# Altium project fast-open-switch r1.0.PrjPcb (part 7 of 8)

## Sheet Spare Pins.SchDoc
size A3; SheetNumber: 20; SheetTotal: 22
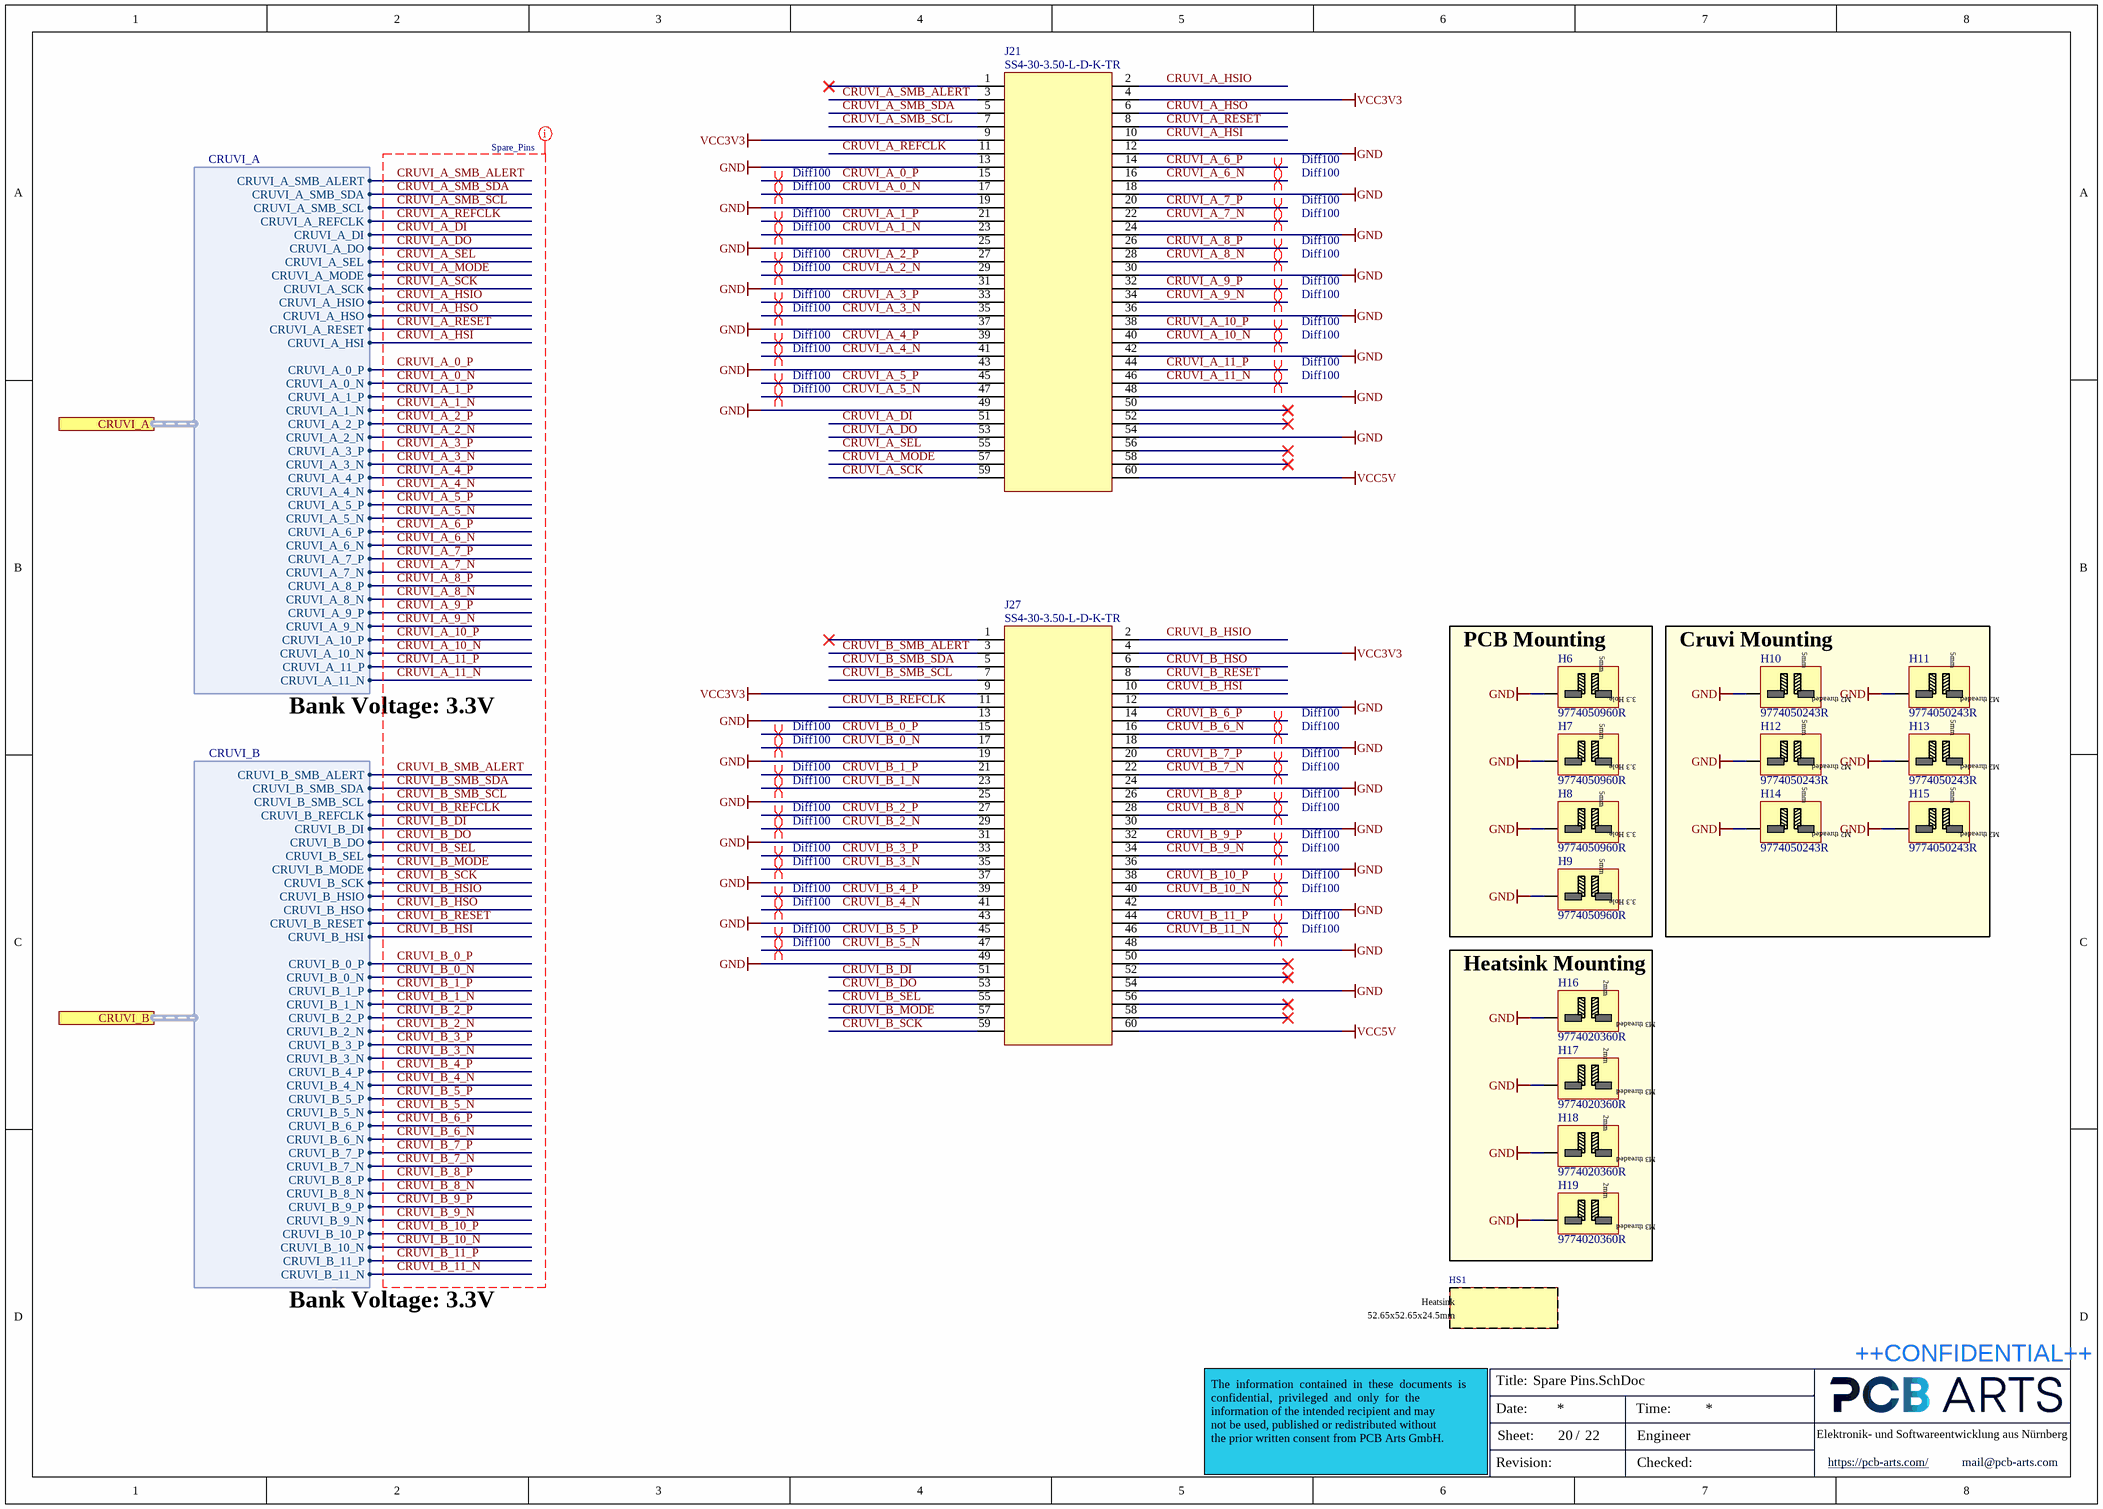
[diagram p21: Spare Pins.SchDoc]

### Parts
H6  9774050960R  [9774050960R]
H7  9774050960R  [9774050960R]
H8  9774050960R  [9774050960R]
H9  9774050960R  [9774050960R]
H10  9774050243R  [9774050243R]
H11  9774050243R  [9774050243R]
H12  9774050243R  [9774050243R]
H13  9774050243R  [9774050243R]
H14  9774050243R  [9774050243R]
H15  9774050243R  [9774050243R]
H16  9774020360R  [9774020360R]
H17  9774020360R  [9774020360R]
H18  9774020360R  [9774020360R]
H19  9774020360R  [9774020360R]
HS1  Heatsink Assembly 52.65x52.65x24.5mm  [ATS-61500W-C2-R0]  (value not drawn)
J21  SS4-30-3.50-L-D-K-TR  [SS4-30-3.50-L-D-K-TR]
J27  SS4-30-3.50-L-D-K-TR  [SS4-30-3.50-L-D-K-TR]

### Blocks framed on the sheet
PCB Mounting: H6-H9
Cruvi Mounting: H10-H15
Heatsink Mounting: H16-H19

### Ports
CRUVI_A (harness CRUVI_A, see Top-Level-Sheet[3C], Bank 13_Bank 15_Bank 16[1C]), CRUVI_B (harness CRUVI_B, see Top-Level-Sheet[3C], Bank 13_Bank 15_Bank 16[3C])

### Harnesses
CRUVI_A: CRUVI_A_SMB_ALERT, CRUVI_A_SMB_SDA, CRUVI_A_SMB_SCL, CRUVI_A_REFCLK, CRUVI_A_DI, CRUVI_A_DO, CRUVI_A_SEL, CRUVI_A_MODE, CRUVI_A_SCK, CRUVI_A_HSIO, CRUVI_A_HSO, CRUVI_A_RESET, CRUVI_A_HSI, CRUVI_A_0_P, CRUVI_A_0_N, CRUVI_A_1_P, CRUVI_A_1_N, CRUVI_A_2_P, CRUVI_A_2_N, CRUVI_A_3_P, CRUVI_A_3_N, CRUVI_A_4_P, CRUVI_A_4_N, CRUVI_A_5_P, CRUVI_A_5_N, CRUVI_A_6_P, CRUVI_A_6_N, CRUVI_A_7_P, CRUVI_A_7_N, CRUVI_A_8_P, CRUVI_A_8_N, CRUVI_A_9_P, CRUVI_A_9_N, CRUVI_A_10_P, CRUVI_A_10_N, CRUVI_A_11_P, CRUVI_A_11_N
CRUVI_B: CRUVI_B_SMB_ALERT, CRUVI_B_SMB_SDA, CRUVI_B_SMB_SCL, CRUVI_B_REFCLK, CRUVI_B_DI, CRUVI_B_DO, CRUVI_B_SEL, CRUVI_B_MODE, CRUVI_B_SCK, CRUVI_B_HSIO, CRUVI_B_HSO, CRUVI_B_RESET, CRUVI_B_HSI, CRUVI_B_0_P, CRUVI_B_0_N, CRUVI_B_1_P, CRUVI_B_1_N, CRUVI_B_2_P, CRUVI_B_2_N, CRUVI_B_3_P, CRUVI_B_3_N, CRUVI_B_4_P, CRUVI_B_4_N, CRUVI_B_5_P, CRUVI_B_5_N, CRUVI_B_6_P, CRUVI_B_6_N, CRUVI_B_7_P, CRUVI_B_7_N, CRUVI_B_8_P, CRUVI_B_8_N, CRUVI_B_9_P, CRUVI_B_9_N, CRUVI_B_10_P, CRUVI_B_10_N, CRUVI_B_11_P, CRUVI_B_11_N

### Nets
GND: H6.1 H7.1 H8.1 H9.1 H10.1 H11.1 H12.1 H13.1 H14.1 H15.1 H16.1 H17.1 H18.1 H19.1 J21.12 J21.13 J21.18 J21.19 J21.24 J21.25 J21.30 J21.31 J21.36 J21.37 J21.42 J21.43 J21.48 J21.49 J21.54 J27.12 J27.13 J27.18 J27.19 J27.24 J27.25 J27.30 J27.31 J27.36 J27.37 J27.42 J27.43 J27.48 J27.49 J27.54
VCC3V3: J21.4 J21.9 J27.4 J27.9
VCC5V: J21.60 J27.60
CRUVI_A_0_N: J21.17 ; port CRUVI_A.CRUVI_A_0_N
CRUVI_A_0_P: J21.15 ; port CRUVI_A.CRUVI_A_0_P
CRUVI_A_1_N: J21.23 ; port CRUVI_A.CRUVI_A_1_N
CRUVI_A_1_P: J21.21 ; port CRUVI_A.CRUVI_A_1_P
CRUVI_A_2_N: J21.29 ; port CRUVI_A.CRUVI_A_2_N
CRUVI_A_2_P: J21.27 ; port CRUVI_A.CRUVI_A_2_P
CRUVI_A_3_N: J21.35 ; port CRUVI_A.CRUVI_A_3_N
CRUVI_A_3_P: J21.33 ; port CRUVI_A.CRUVI_A_3_P
CRUVI_A_4_N: J21.41 ; port CRUVI_A.CRUVI_A_4_N
CRUVI_A_4_P: J21.39 ; port CRUVI_A.CRUVI_A_4_P
CRUVI_A_5_N: J21.47 ; port CRUVI_A.CRUVI_A_5_N
CRUVI_A_5_P: J21.45 ; port CRUVI_A.CRUVI_A_5_P
CRUVI_A_6_N: J21.16 ; port CRUVI_A.CRUVI_A_6_N
CRUVI_A_6_P: J21.14 ; port CRUVI_A.CRUVI_A_6_P
CRUVI_A_7_N: J21.22 ; port CRUVI_A.CRUVI_A_7_N
CRUVI_A_7_P: J21.20 ; port CRUVI_A.CRUVI_A_7_P
CRUVI_A_8_N: J21.28 ; port CRUVI_A.CRUVI_A_8_N
CRUVI_A_8_P: J21.26 ; port CRUVI_A.CRUVI_A_8_P
CRUVI_A_9_N: J21.34 ; port CRUVI_A.CRUVI_A_9_N
CRUVI_A_9_P: J21.32 ; port CRUVI_A.CRUVI_A_9_P
CRUVI_A_10_N: J21.40 ; port CRUVI_A.CRUVI_A_10_N
CRUVI_A_10_P: J21.38 ; port CRUVI_A.CRUVI_A_10_P
CRUVI_A_11_N: J21.46 ; port CRUVI_A.CRUVI_A_11_N
CRUVI_A_11_P: J21.44 ; port CRUVI_A.CRUVI_A_11_P
CRUVI_A_DI: J21.51 ; port CRUVI_A.CRUVI_A_DI
CRUVI_A_DO: J21.53 ; port CRUVI_A.CRUVI_A_DO
CRUVI_A_HSI: J21.10 ; port CRUVI_A.CRUVI_A_HSI
CRUVI_A_HSIO: J21.2 ; port CRUVI_A.CRUVI_A_HSIO
CRUVI_A_HSO: J21.6 ; port CRUVI_A.CRUVI_A_HSO
CRUVI_A_MODE: J21.57 ; port CRUVI_A.CRUVI_A_MODE
CRUVI_A_REFCLK: J21.11 ; port CRUVI_A.CRUVI_A_REFCLK
CRUVI_A_RESET: J21.8 ; port CRUVI_A.CRUVI_A_RESET
CRUVI_A_SCK: J21.59 ; port CRUVI_A.CRUVI_A_SCK
CRUVI_A_SEL: J21.55 ; port CRUVI_A.CRUVI_A_SEL
CRUVI_A_SMB_ALERT: J21.3 ; port CRUVI_A.CRUVI_A_SMB_ALERT
CRUVI_A_SMB_SCL: J21.7 ; port CRUVI_A.CRUVI_A_SMB_SCL
CRUVI_A_SMB_SDA: J21.5 ; port CRUVI_A.CRUVI_A_SMB_SDA
CRUVI_B_0_N: J27.17 ; port CRUVI_B.CRUVI_B_0_N
CRUVI_B_0_P: J27.15 ; port CRUVI_B.CRUVI_B_0_P
CRUVI_B_1_N: J27.23 ; port CRUVI_B.CRUVI_B_1_N
CRUVI_B_1_P: J27.21 ; port CRUVI_B.CRUVI_B_1_P
CRUVI_B_2_N: J27.29 ; port CRUVI_B.CRUVI_B_2_N
CRUVI_B_2_P: J27.27 ; port CRUVI_B.CRUVI_B_2_P
CRUVI_B_3_N: J27.35 ; port CRUVI_B.CRUVI_B_3_N
CRUVI_B_3_P: J27.33 ; port CRUVI_B.CRUVI_B_3_P
CRUVI_B_4_N: J27.41 ; port CRUVI_B.CRUVI_B_4_N
CRUVI_B_4_P: J27.39 ; port CRUVI_B.CRUVI_B_4_P
CRUVI_B_5_N: J27.47 ; port CRUVI_B.CRUVI_B_5_N
CRUVI_B_5_P: J27.45 ; port CRUVI_B.CRUVI_B_5_P
CRUVI_B_6_N: J27.16 ; port CRUVI_B.CRUVI_B_6_N
CRUVI_B_6_P: J27.14 ; port CRUVI_B.CRUVI_B_6_P
CRUVI_B_7_N: J27.22 ; port CRUVI_B.CRUVI_B_7_N
CRUVI_B_7_P: J27.20 ; port CRUVI_B.CRUVI_B_7_P
CRUVI_B_8_N: J27.28 ; port CRUVI_B.CRUVI_B_8_N
CRUVI_B_8_P: J27.26 ; port CRUVI_B.CRUVI_B_8_P
CRUVI_B_9_N: J27.34 ; port CRUVI_B.CRUVI_B_9_N
CRUVI_B_9_P: J27.32 ; port CRUVI_B.CRUVI_B_9_P
CRUVI_B_10_N: J27.40 ; port CRUVI_B.CRUVI_B_10_N
CRUVI_B_10_P: J27.38 ; port CRUVI_B.CRUVI_B_10_P
CRUVI_B_11_N: J27.46 ; port CRUVI_B.CRUVI_B_11_N
CRUVI_B_11_P: J27.44 ; port CRUVI_B.CRUVI_B_11_P
CRUVI_B_DI: J27.51 ; port CRUVI_B.CRUVI_B_DI
CRUVI_B_DO: J27.53 ; port CRUVI_B.CRUVI_B_DO
CRUVI_B_HSI: J27.10 ; port CRUVI_B.CRUVI_B_HSI
CRUVI_B_HSIO: J27.2 ; port CRUVI_B.CRUVI_B_HSIO
CRUVI_B_HSO: J27.6 ; port CRUVI_B.CRUVI_B_HSO
CRUVI_B_MODE: J27.57 ; port CRUVI_B.CRUVI_B_MODE
CRUVI_B_REFCLK: J27.11 ; port CRUVI_B.CRUVI_B_REFCLK
CRUVI_B_RESET: J27.8 ; port CRUVI_B.CRUVI_B_RESET
CRUVI_B_SCK: J27.59 ; port CRUVI_B.CRUVI_B_SCK
CRUVI_B_SEL: J27.55 ; port CRUVI_B.CRUVI_B_SEL
CRUVI_B_SMB_ALERT: J27.3 ; port CRUVI_B.CRUVI_B_SMB_ALERT
CRUVI_B_SMB_SCL: J27.7 ; port CRUVI_B.CRUVI_B_SMB_SCL
CRUVI_B_SMB_SDA: J27.5 ; port CRUVI_B.CRUVI_B_SMB_SDA

Not connected (* = marked no-connect by the designer): J21 1* 50* 52* 56* 58*; J27 1* 50* 52* 56* 58*

### Layout directives
net class Spare_Pins: CRUVI_A_0_N, CRUVI_A_0_P, CRUVI_A_1_N, CRUVI_A_1_P, CRUVI_A_2_N, CRUVI_A_2_P, CRUVI_A_3_N, CRUVI_A_3_P, CRUVI_A_4_N, CRUVI_A_4_P, CRUVI_A_5_N, CRUVI_A_5_P, CRUVI_A_6_N, CRUVI_A_6_P, CRUVI_A_7_N, CRUVI_A_7_P, CRUVI_A_8_N, CRUVI_A_8_P, CRUVI_A_9_N, CRUVI_A_9_P, CRUVI_A_10_N, CRUVI_A_10_P, CRUVI_A_11_N, CRUVI_A_11_P, CRUVI_A_DI, CRUVI_A_DO, CRUVI_A_HSI, CRUVI_A_HSIO, CRUVI_A_HSO, CRUVI_A_MODE, CRUVI_A_REFCLK, CRUVI_A_RESET, CRUVI_A_SCK, CRUVI_A_SEL, CRUVI_A_SMB_ALERT, CRUVI_A_SMB_SCL, CRUVI_A_SMB_SDA, CRUVI_B_0_N, CRUVI_B_0_P, CRUVI_B_1_N, CRUVI_B_1_P, CRUVI_B_2_N, CRUVI_B_2_P, CRUVI_B_3_N, CRUVI_B_3_P, CRUVI_B_4_N, CRUVI_B_4_P, CRUVI_B_5_N, CRUVI_B_5_P, CRUVI_B_6_N, CRUVI_B_6_P, CRUVI_B_7_N, CRUVI_B_7_P, CRUVI_B_8_N, CRUVI_B_8_P, CRUVI_B_9_N, CRUVI_B_9_P, CRUVI_B_10_N, CRUVI_B_10_P, CRUVI_B_11_N, CRUVI_B_11_P, CRUVI_B_DI, CRUVI_B_DO, CRUVI_B_HSI, CRUVI_B_HSIO, CRUVI_B_HSO, CRUVI_B_MODE, CRUVI_B_REFCLK, CRUVI_B_RESET, CRUVI_B_SCK, CRUVI_B_SEL, CRUVI_B_SMB_ALERT, CRUVI_B_SMB_SCL, CRUVI_B_SMB_SDA
differential pair; net class Diff100: CRUVI_A_0_N, CRUVI_A_0_P, CRUVI_A_1_N, CRUVI_A_1_P, CRUVI_A_2_N, CRUVI_A_2_P, CRUVI_A_3_N, CRUVI_A_3_P, CRUVI_A_4_N, CRUVI_A_4_P, CRUVI_A_5_N, CRUVI_A_5_P, CRUVI_A_6_N, CRUVI_A_6_P, CRUVI_A_7_N, CRUVI_A_7_P, CRUVI_A_8_N, CRUVI_A_8_P, CRUVI_A_9_N, CRUVI_A_9_P, CRUVI_A_10_N, CRUVI_A_10_P, CRUVI_A_11_N, CRUVI_A_11_P, CRUVI_B_0_N, CRUVI_B_0_P, CRUVI_B_1_N, CRUVI_B_1_P, CRUVI_B_2_N, CRUVI_B_2_P, CRUVI_B_3_N, CRUVI_B_3_P, CRUVI_B_4_N, CRUVI_B_4_P, CRUVI_B_5_N, CRUVI_B_5_P, CRUVI_B_6_N, CRUVI_B_6_P, CRUVI_B_7_N, CRUVI_B_7_P, CRUVI_B_8_N, CRUVI_B_8_P, CRUVI_B_9_N, CRUVI_B_9_P, CRUVI_B_10_N, CRUVI_B_10_P, CRUVI_B_11_N, CRUVI_B_11_P

### Notes on the sheet
- Bank Voltage: 3.3V
- Title:
- ++CONFIDENTIAL++
- Date:
- Sheet:
- /
- Time:
- Engineer
- Elektronik- und Softwareentwicklung aus Nürnberg
- The  information  contained  in  these  documents  is  confidential,  privileged  and  only  for  the
  information of the intended recipient and may
  not be used, published or redistributed without
  the prior written consent from PCB Arts GmbH.
- Revision:
- Checked:
- https://pcb-arts.com/
- mail@pcb-arts.com
- (in symbol ATS-61500W-C2-R0_Heatsink Assembly 52.65x52.65x24.5mm) Heatsink; 52.65x52.65x24.5mm
- (in symbol Würth Standoff M2 h:5mm) 5mm; M2 threaded
- (in symbol Würth Standoff M3 h:2mm) 2mm; M3 threaded
- (in symbol Würth Standoff TH3.3 h:5mm) 5mm; 3.3 Hole

### Library data of the parts
H6-H9 = Würth Standoff TH3.3 h:5mm: Würth Standoff TH3.3 h:5mm 9774050960R; Manufacturer 1: Würth Elektronik; Manufacturer 2 Prt. Nr.: 78614050960; Manufacturer 1 Prt. Nr.: 9774050960R; Manufacturer 2: Würth Elektronik
H10-H15 = Würth Standoff M2 h:5mm: Würth Standoff M2 h:5mm 9774050243R; Manufacturer 1: Würth Elektronik; Manufacturer 1 Prt. Nr.: 9774050243R
H16-H19 = Würth Standoff M3 h:2mm: Würth Standoff M3 h:2mm 9774020360R; Manufacturer 1: Würth Elektronik; Manufacturer 1 Prt. Nr.: 9774020360R
HS1 = ATS-61500W-C2-R0_Heatsink Assembly 52.65x52.65x24.5mm: Machined Copper Heatsink for GaN Devices; Manufacturer 1: Advanced Thermal Solutions; Manufacturer 1 Prt. Nr.: ATS-61500W-C2-R0
J21 J27 = SS4-30-3.50-L-D-K-TR: Platine-zu-Platine & Mezzanine-Steckverbinder 0.40 mm Micro Blade & Beam Ultra Fine Pitch Socket; Manufacturer 1: Samtec; Manufacturer 1 Prt. Nr.: SS4-30-3.50-L-D-K-TR